# EAGLE design Cmp and Inv (EAGLE 5.11)

## Sheet 1 of 3
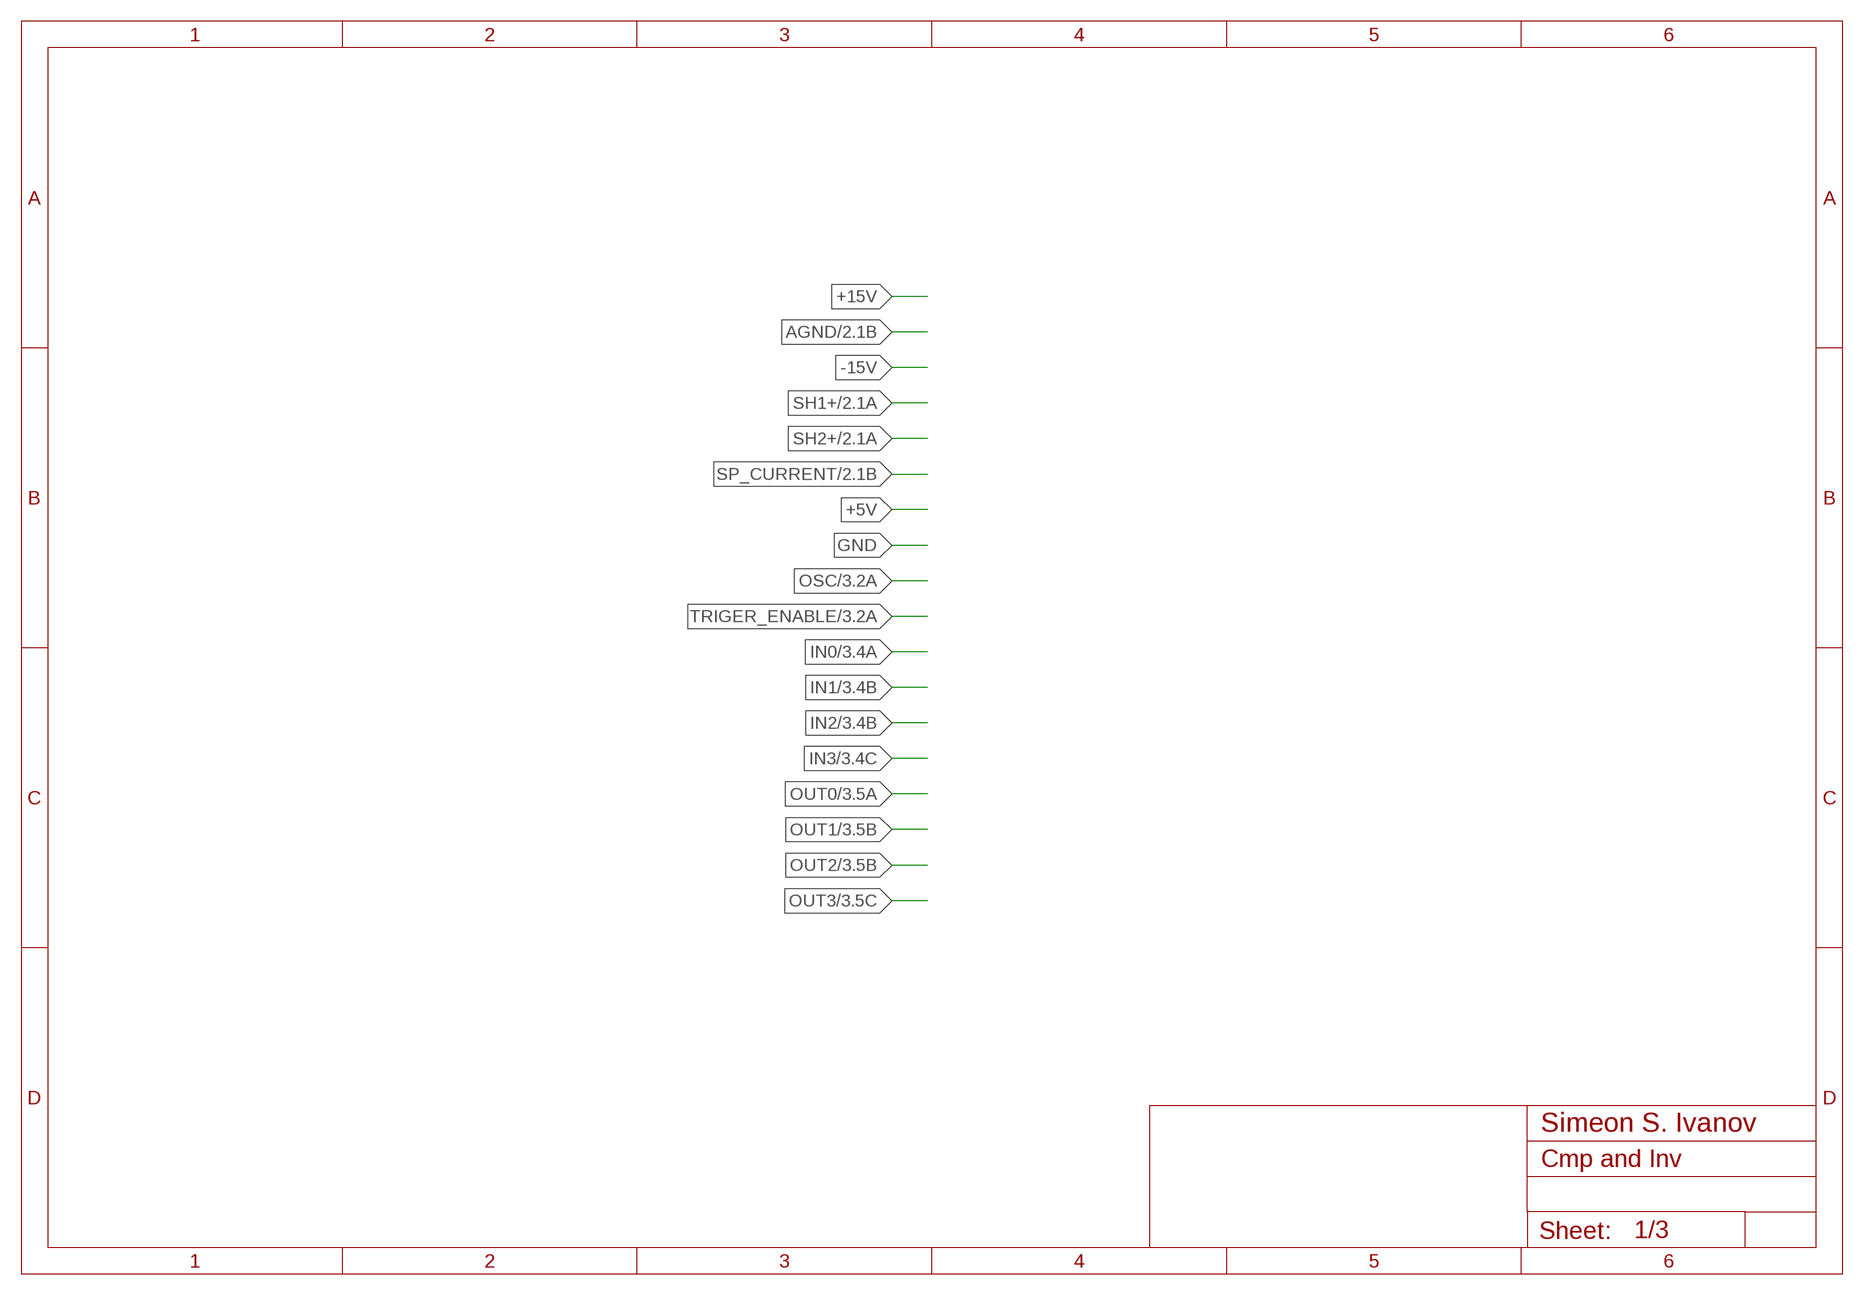
[diagram p0: schematic, sheet 1]

### Notes on the sheet
- Simeon S. Ivanov

## Sheet 2 of 3
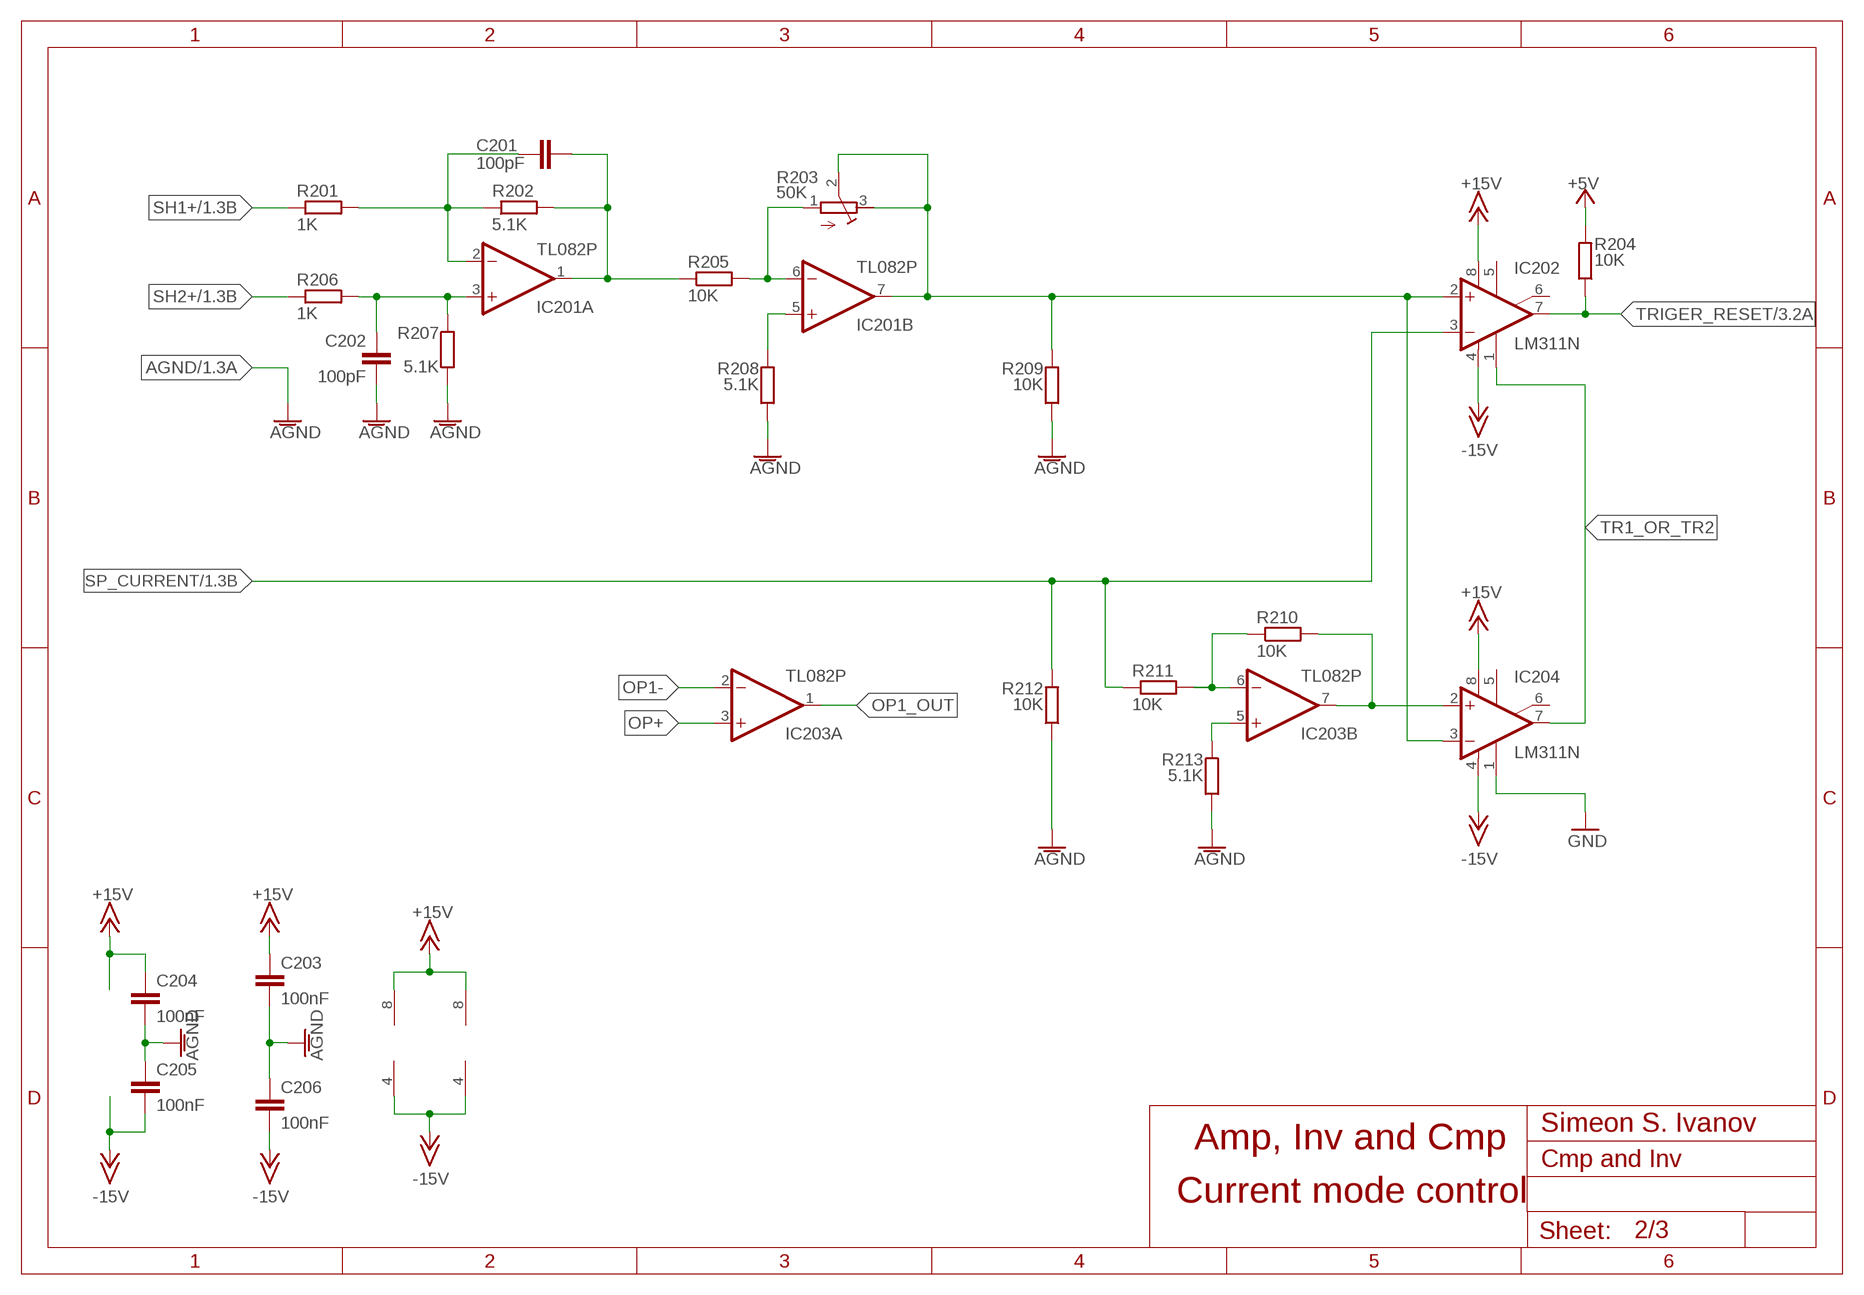
[diagram p1: schematic, sheet 2]

### Parts
C201  100pF  C-EU025-024X044  [C025-024X044]
C202  100pF  C-EU025-024X044  [C025-024X044]
C203  100nF  C-EUC0603  [C0603]
C204  100nF  C-EUC0603  [C0603]
C205  100nF  C-EUC0603  [C0603]
C206  100nF  C-EUC0603  [C0603]
IC201  TL082P  [DIL08]
IC202  LM311N  [DIL08]
IC203  TL082P  [DIL08]
IC204  LM311N  [DIL08]
R201  1K  R-EU_0204/5  [0204/5]
R202  5.1K  R-EU_0204/5  [0204/5]
R203  50K  R-TRIMM3296W  [RTRIM3296W]
R204  10K  R-EU_0204/5  [0204/5]
R205  10K  R-EU_0204/5  [0204/5]
R206  1K  R-EU_0204/5  [0204/5]
R207  5.1K  R-EU_0204/5  [0204/5]
R208  5.1K  R-EU_0204/5  [0204/5]
R209  10K  R-EU_0204/5  [0204/5]
R210  10K  R-EU_0204/5  [0204/5]
R211  10K  R-EU_0204/5  [0204/5]
R212  10K  R-EU_0204/5  [0204/5]
R213  5.1K  R-EU_0204/5  [0204/5]

### Nets
+5V: R204.2 ; also sheet 1,3
+15V: C203.1 C204.1 IC201.8(P:V+) IC202.8(V+) IC203.8(P:V+) IC204.8(V+) ; also sheet 1
-15V: C205.2 C206.2 IC201.4(P:V-) IC202.4(V-) IC203.4(P:V-) IC204.4(V-) ; also sheet 1
AGND: C202.1 C203.2 C204.2 C205.1 C206.1 R207.2 R208.2 R209.2 R212.1 R213.2 ; also sheet 1
ANALOG_IN_AC: IC201.7(B:OUT) IC202.2(+IN) IC204.3(-IN) R203.2(S) R203.3(A) R209.1
GND: IC204.1(GND) ; also sheet 1,3
N$6: C201.1 IC201.2(A:-IN) R201.2 R202.1
N$10: C202.2 IC201.3(A:+IN) R206.2 R207.1
N$37: IC201.5(B:+IN) R208.1
N$38: IC201.6(B:-IN) R203.1(E) R205.2
N$100: C201.2 IC201.1(A:OUT) R202.2 R205.1
N$102: IC203.7(B:OUT) IC204.2(+IN) R210.2
N$103: IC203.6(B:-IN) R210.1 R211.2
N$104: IC203.5(B:+IN) R213.1
OP1-: IC203.2(A:-IN)
OP1_OUT: IC203.1(A:OUT)
OP+: IC203.3(A:+IN)
SH1+: R201.1 ; also sheet 1
SH2+: R206.1 ; also sheet 1
SP_CURRENT: IC202.3(-IN) R211.1 R212.2 ; also sheet 1
TR1_OR_TR2: IC202.1(GND) IC204.7(OUT)
TRIGER_RESET: IC202.7(OUT) R204.1 ; also sheet 3
Unconnected: IC202.5(ON) IC202.6(ON/STR) IC204.5(ON) IC204.6(ON/STR)

### Notes on the sheet
- Simeon S. Ivanov
- Amp, Inv and Cmp
- Current mode control

## Sheet 3 of 3
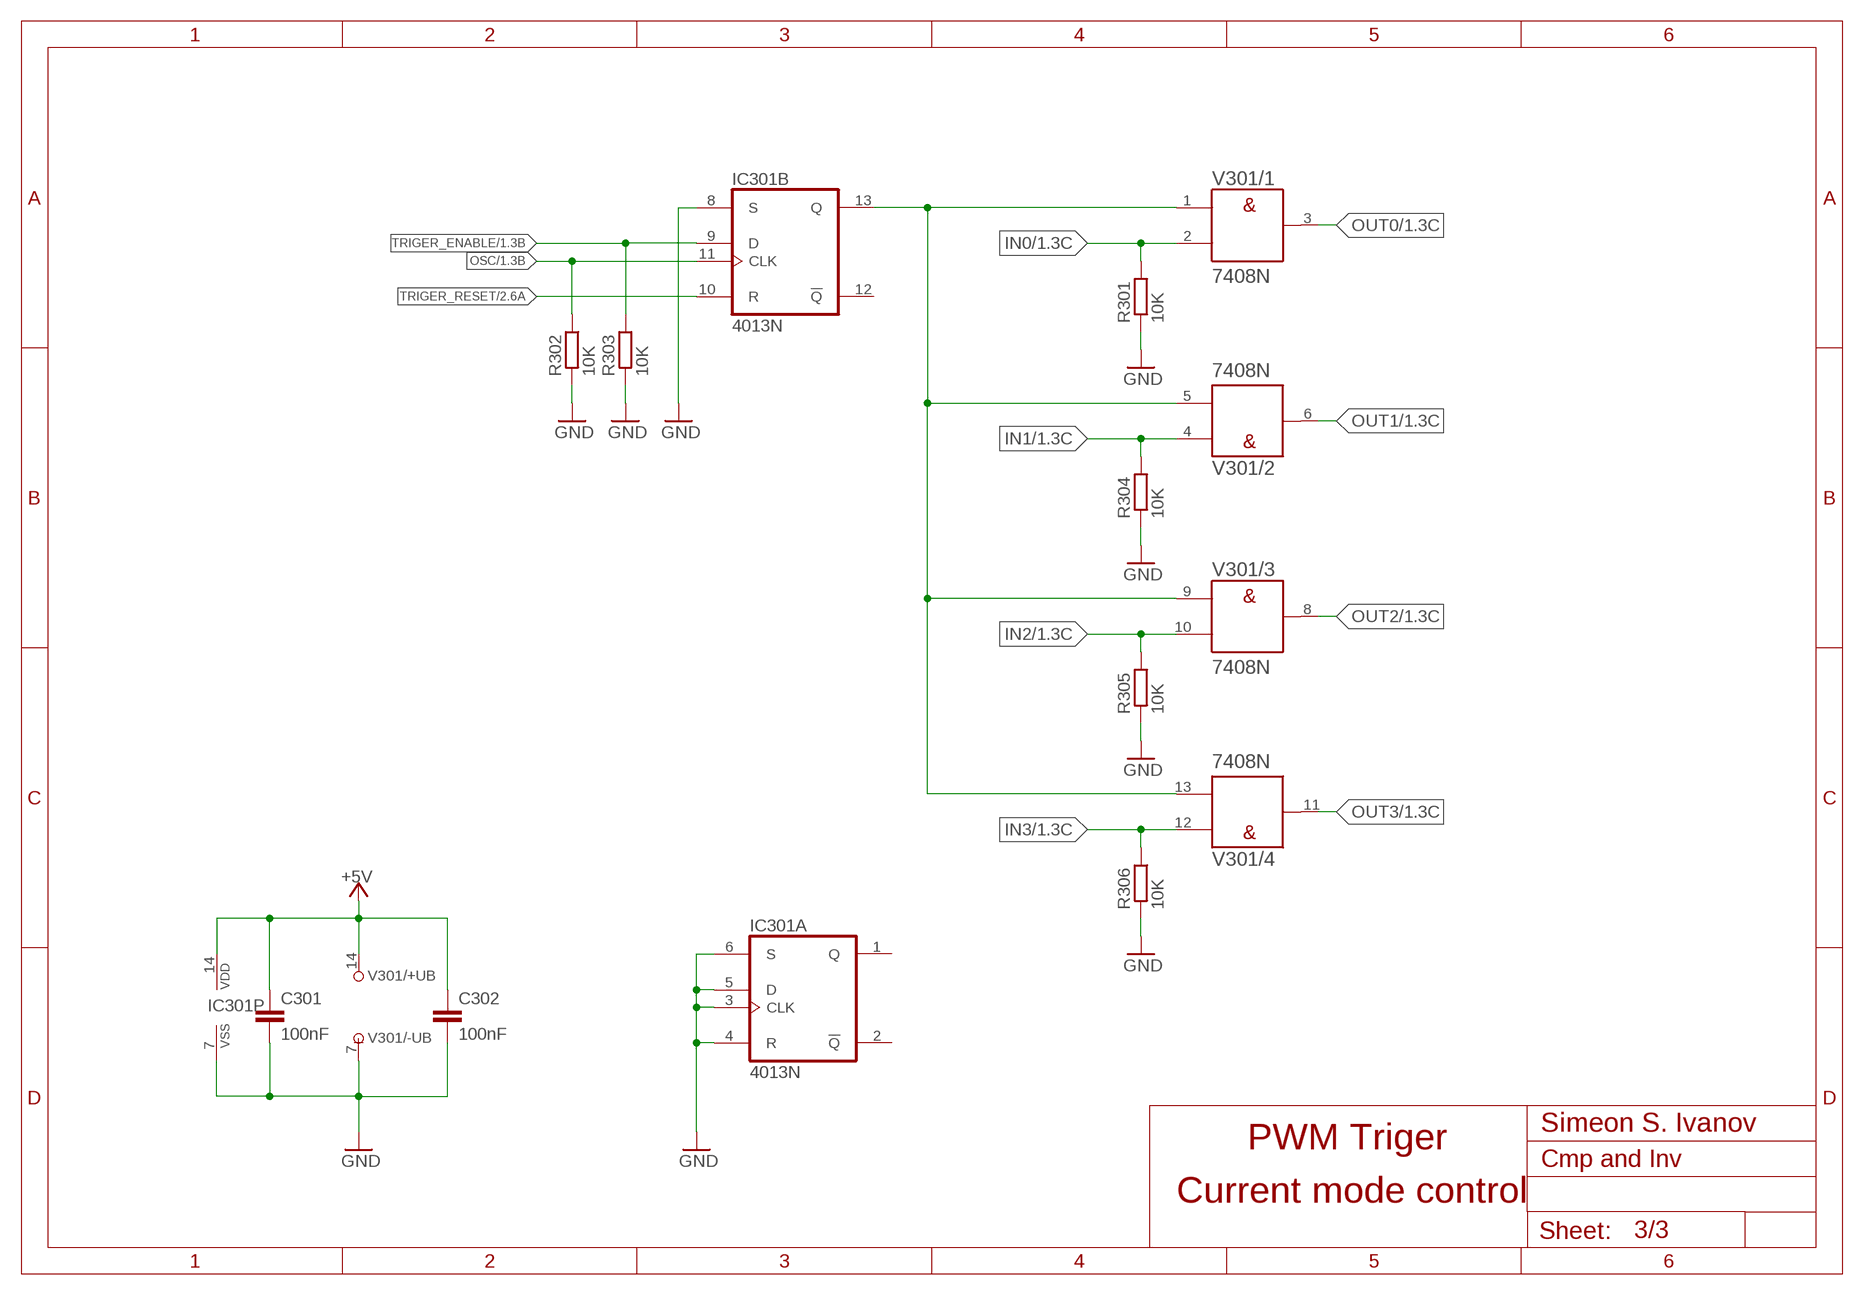
[diagram p2: schematic, sheet 3]

### Parts
C301  100nF  C-EUC0805  [C0805]
C302  100nF  C-EUC0805  [C0805]
IC301  4013N  [DIL14]
R301  10K  R-EU_0204/5  [0204/5]
R302  10K  R-EU_0204/5  [0204/5]
R303  10K  R-EU_0204/5  [0204/5]
R304  10K  R-EU_0204/5  [0204/5]
R305  10K  R-EU_0204/5  [0204/5]
R306  10K  R-EU_0204/5  [0204/5]
V301  7408N  [DIL14]

### Nets
+5V: C301.1 C302.1 IC301.14(P:VDD) V301.14(/+UB:+UB) ; also sheet 1,2
GND: C301.2 C302.2 IC301.3(A:CLK) IC301.4(A:R) IC301.5(A:D) IC301.6(A:S) IC301.7(P:VSS) IC301.8(B:S) R301.2 R302.2 R303.2 R304.2 R305.2 R306.2 V301.7(/-UB:-UB) ; also sheet 1,2
IN0: R301.1 V301.2(/1:B) ; also sheet 1
IN1: R304.1 V301.4(/2:A) ; also sheet 1
IN2: R305.1 V301.10(/3:B) ; also sheet 1
IN3: R306.1 V301.12(/4:A) ; also sheet 1
OSC: IC301.11(B:CLK) R302.1 ; also sheet 1
OUT0: V301.3(/1:Y) ; also sheet 1
OUT1: V301.6(/2:Y) ; also sheet 1
OUT2: V301.8(/3:Y) ; also sheet 1
OUT3: V301.11(/4:Y) ; also sheet 1
TR_EN_GATE: IC301.13(B:Q) V301.1(/1:A) V301.5(/2:B) V301.9(/3:A) V301.13(/4:B)
TRIGER_ENABLE: IC301.9(B:D) R303.1 ; also sheet 1
TRIGER_RESET: IC301.10(B:R) ; also sheet 2
Unconnected: IC301.1(A:Q) IC301.2(A:!Q) IC301.12(B:!Q)

### Notes on the sheet
- Simeon S. Ivanov
- PWM Triger
- Current mode control

## Library data of the parts
C201-C206 C301 C302 = rcl:C-EU: CAPACITOR, European symbol
IC201 IC203 = linear:TL082: OP AMP
IC202 IC204 = linear:LM311: COMPARATOR
IC301 = 40xx:4013: Dual D FLIP FLOP, set/reset
R201 R202 R204-R213 R301-R306 = rcl:R-EU_: RESISTOR, European symbol
R203 = rcl:R-TRIMM: Trimm resistor
V301 = 74ttl-din:74*08: Quad 2-input AND gate

## Board
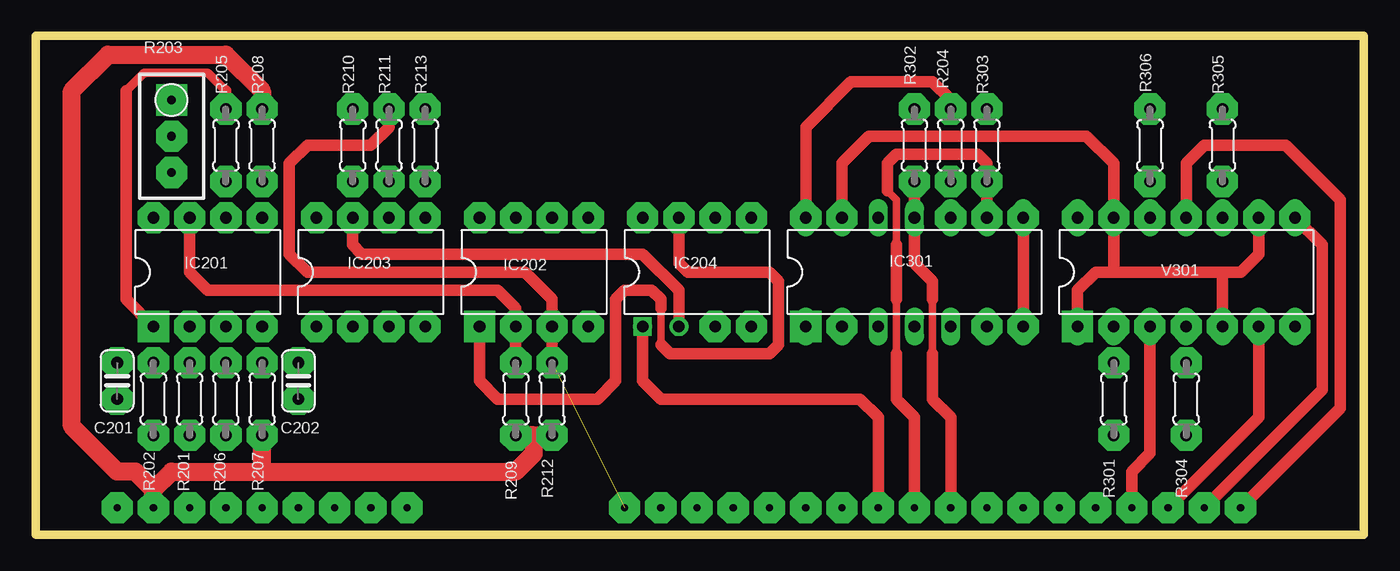
[diagram p3: board, top side]
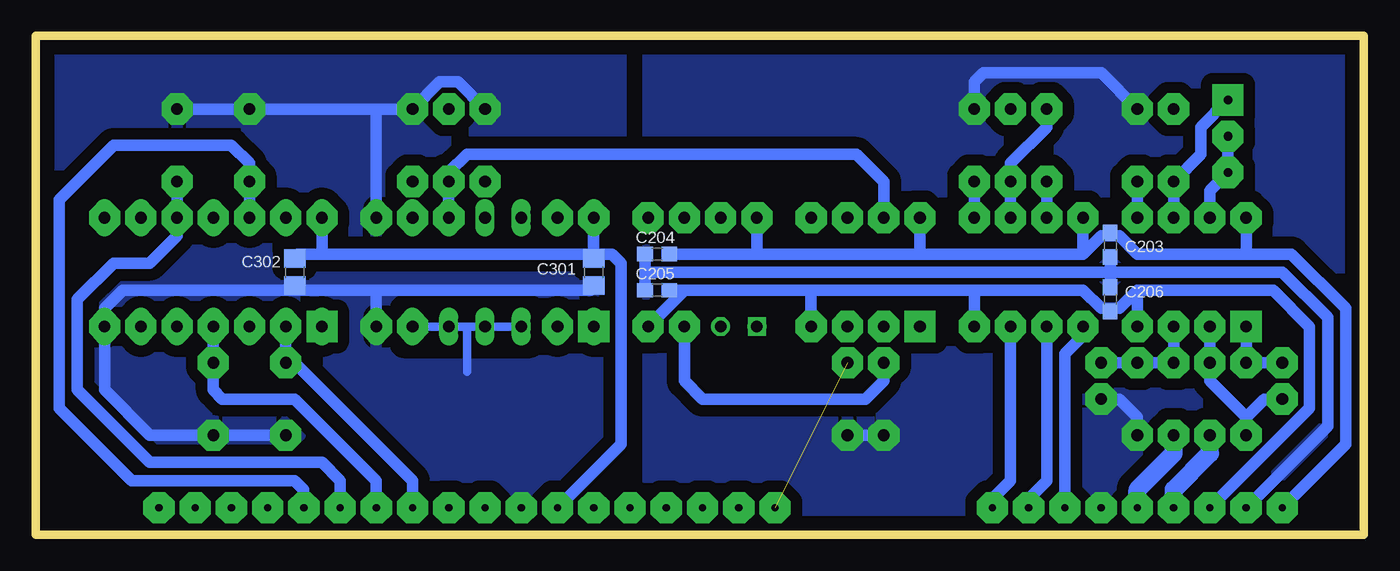
[diagram p4: board, bottom side, seen from below]

Size 93.09 x 34.98 mm. Coordinates in mm from the lower left corner, seen from the top.
Outline: 0,0 93.09,0 93.09,34.98 0,34.98 0,0
Copper layers (1*16): Top 0.035mm / dielectric 1.5mm / Bottom 0.035mm
Design rules "default": minimum track width 10mil, minimum drill 24mil, track to track 8mil, track to pad 8mil, pad to pad 8mil, via to via 8mil, smd to smd 8mil, copper to edge 40mil, drill to drill 8mil, minimum pad ring 10mil, minimum via ring 8mil, stop-mask expansion 4mil, vias tented up to drill 0mil, thermal gap 10mil
bRestrict: area 58.4,13.3 to 67.3,15.9

### Footprints (pad centres in the part's own frame; a part is rotated, then mirrored left to right if it is on the bottom)
C025-024X044 = drill 0.813 octagon: 1 -1.27,0; 2 1.27,0
C0603 = smd 1.1 x 1: 1 -0.85,0; 2 0.85,0
C0805 = smd 1.3 x 1.5: 1 -0.95,0; 2 0.95,0
DIL08 = drill 0.813 pad 1.27 round: 1 -3.81,-3.81; 2 -1.27,-3.81; 3 1.27,-3.81; 4 3.81,-3.81; 5 3.81,3.81; 6 1.27,3.81; 7 -1.27,3.81; 8 -3.81,3.81
DIL14 = drill 0.813 long: 1 -7.62,-3.81; 2 -5.08,-3.81; 3 -2.54,-3.81; 4 0,-3.81; 5 2.54,-3.81; 6 5.08,-3.81; 7 7.62,-3.81; 8 7.62,3.81; 9 5.08,3.81; 10 2.54,3.81; 11 0,3.81; 12 -2.54,3.81; 13 -5.08,3.81; 14 -7.62,3.81
0204/5 = drill 0.813 octagon: 1 -2.54,0; 2 2.54,0
RTRIM3296W = drill 0.61 round: 1 0,-2.54; 2 0,0; 3 0,2.54

### Placement (x,y rotation side)
C201  5.71,10.79 90 top
C202  18.41,10.79 90 top
C203  17.78,20.32 270 bottom
C204  49.53,19.68 180 bottom
C205  49.53,17.14 0 bottom
C206  17.78,16.51 270 bottom
C301  53.98,18.41 270 bottom
C302  74.93,18.41 270 bottom
IC201  12.06,18.41 0 top
IC202  34.92,18.41 0 top
IC203  23.5,18.41 0 top
IC204  46.35,18.41 0 top
IC301  61.59,18.41 0 top
R201  10.79,9.53 90 top
R202  8.26,9.53 90 top
R203  9.53,27.94 180 top
R204  64.14,27.3 90 top
R205  13.34,27.3 270 top
R206  13.34,9.53 90 top
R207  15.88,9.53 270 top
R208  15.88,27.3 90 top
R209  33.66,9.53 270 top
R210  22.23,27.3 270 top
R211  24.77,27.3 270 top
R212  36.2,9.53 90 top
R213  27.3,27.3 90 top
R301  75.56,9.53 270 top
R302  61.59,27.3 90 top
R303  66.67,27.3 90 top
R304  80.64,9.53 270 top
R305  83.19,27.3 90 top
R306  78.11,27.3 90 top
V301  80.64,18.41 0 top

### Tracks (layer width: path | path; a pad name or v marks a point on that pad's centre or on a via)
+5V  (via drill 0.5 pad 2.18)
  Top 0.813: R204.2 64.14,30.48 62.87,31.75 57.15,31.75 53.98,28.57 v53.98,22.23
  Bottom 0.813: 53.98,19.68 73.03,19.68 | 73.03,19.68 v73.03,22.23 | 53.98,19.68 v53.98,22.23 | 53.98,19.68 52.7,19.68 52.07,19.05 52.07,6.35 v56.52,1.91 | 73.03,19.68 74.61,19.68 arc-90 C302.1 | 53.98,19.68 C301.1
  other vias: 64.14,29.84
+15V  (via drill 0.5 pad 2.18)
  Bottom 0.813: 8.26,19.68 v8.26,22.23 | 8.26,19.68 15.88,19.68 17.14,20.95 17.78,20.95 | 17.78,20.95 18.41,20.95 19.68,19.68 | 19.68,19.68 31.11,19.68 | 31.11,19.68 42.55,19.68 | 42.55,19.68 v42.55,22.23 | 31.11,19.68 v31.11,22.23 | 19.68,19.68 v19.68,22.23 | 42.55,19.68 C204.1 | 17.78,20.95 C203.1 | v5.71,1.91 1.27,6.35 1.27,15.88 5.08,19.68 8.26,19.68
-15V  (via drill 0.5 pad 2.18)
  Bottom 0.813: 27.3,17.14 v27.3,14.61 | 15.88,17.14 6.35,17.14 3.81,14.61 3.81,8.89 v10.79,1.91 | 15.88,17.14 17.14,15.88 17.78,15.88 | 17.78,15.88 18.41,15.88 19.68,17.14 27.3,17.14 | 27.3,17.14 38.73,17.14 | 38.73,17.14 47.62,17.14 | 47.62,17.14 v50.16,14.61 | 38.73,17.14 v38.73,14.61 | 15.88,17.14 v15.88,14.61 | 47.62,17.14 C205.2 | 17.78,15.88 C206.2
AGND  (via drill 0.5 pad 2.18)
  Top 1.27: v8.26,1.91 8.26,3.17 | 8.26,3.17 6.99,4.45 5.71,4.45 2.54,7.62 2.54,31.11 5.08,33.66 13.34,33.66 15.88,31.11 R208.2 | 8.26,3.17 9.53,4.45 15.88,4.45 | 15.88,4.45 33.66,4.45 34.92,5.71 34.92,6.99 | 34.92,6.99 R209.2 | 34.92,6.99 R212.1 | 15.88,4.45 R207.2
  Bottom 0.813: R208.2 18.41,32.38 26.67,32.38 27.3,31.75 R213.2 | 50.38,18.41 C205.1 | 50.38,18.41 C204.2 | 17.78,18.41 50.38,18.41 | 17.78,18.41 C206.1 | 17.78,18.41 C203.2 | 17.78,18.41 5.71,18.41 2.54,15.24 2.54,7.62 v8.26,1.91 | R207.2 15.88,8.26 17.14,9.53 C202.1 | R209.2 R212.1
  other vias: 18.41,9.53 15.88,6.99 15.88,29.84 27.3,29.84 36.2,6.99 33.66,6.99 18.41,1.91
  pour Bottom (isolate 0.813): 50.16,34.92 50.16,0 0,0 0,34.92
ANALOG_IN_AC  (via drill 0.5 pad 2.18)
  Top 0.813: v10.79,22.23 10.79,18.41 12.06,17.14 32.38,17.14 33.66,15.88 v33.66,14.61 v33.66,12.06
  Bottom 0.813: R203.2 R203.3 10.79,24.13 v10.79,22.23 | v47.62,14.61 47.62,10.79 46.35,9.53 36.2,9.53 34.92,9.53 33.66,10.79 v33.66,12.06
  other vias: 9.53,25.4 9.53,27.94
GND  (via drill 0.5 pad 1.27, 0.5 pad 2.18)
  Top 0.813: v69.22,14.61 v69.22,22.23 | v42.55,14.61 42.55,10.79 43.81,9.53 57.78,9.53 59.05,8.26 v59.05,1.91
  Bottom 0.61: v59.05,14.61 v61.59,14.61 62.87,14.61 | 62.87,14.61 v64.14,14.61 v66.67,14.61 | 62.87,14.61 62.87,11.43
  Bottom 0.813: 69.22,17.14 v69.22,14.61 | 69.22,17.14 74.93,17.14 | 74.93,17.14 87,17.14 88.27,15.88 v88.27,14.61 88.27,10.16 85.09,6.99 R304.2 R301.2 | v69.22,22.23 69.22,29.84 | 69.22,29.84 R303.2 64.77,31.75 63.5,31.75 R302.2 | 69.22,29.84 R306.2 R305.2 | 74.93,17.14 C302.2 | 69.22,17.14 54.3,17.14 arc-90 C301.2
  other vias: 83.19,29.84 75.56,6.99 80.64,6.99 78.11,29.84 66.67,29.84 61.59,29.84
  pour Bottom (isolate 0.813, rank 2): 52.07,0 52.07,34.92 93.34,34.92 93.34,0
IN0  (via drill 0.5 pad 2.18)
  Bottom 0.813: v75.56,14.61 v75.56,12.06 74.93,12.06 66.67,3.81 v66.67,1.91
IN1  (via drill 0.5 pad 2.18)
  Bottom 0.813: v80.64,14.61 v80.64,12.06 80.64,10.16 80.01,9.53 74.93,9.53 69.22,3.81 v69.22,1.91
IN2  (via drill 0.5 pad 2.18)
  Bottom 0.813: R305.1 v83.19,22.23 83.19,20.95 85.09,19.05 87.63,19.05 90.17,16.51 90.17,10.16 85.09,5.08 73.03,5.08 71.75,3.81 v71.75,1.91
  other vias: 83.19,24.77
IN3  (via drill 0.5 pad 2.18)
  Bottom 0.813: v74.3,1.91 74.3,3.17 74.93,3.81 86.36,3.81 91.44,8.89 91.44,23.5 87.63,27.3 79.38,27.3 78.11,26.04 R306.1 v78.11,22.23
  other vias: 78.11,24.77
N$4  (via drill 0.5 pad 2.18)
  other vias: 36.2,22.23
N$5  (via drill 0.5 pad 2.18)
  other vias: 38.73,22.23
N$6  (via drill 0.5 pad 2.18)
  Bottom 0.813: v10.79,14.61 v10.79,12.06 10.79,10.79 8.26,8.26 | 8.26,8.26 R202.1 8.26,8.26 | C201.1 6.99,9.53 8.26,8.26
  other vias: 8.26,6.99 5.71,9.53
N$7  (via drill 0.5 pad 2.18)
  other vias: 47.62,22.23
N$8  (via drill 0.5 pad 2.18)
  other vias: 50.16,22.23
N$9  (via drill 0.5 pad 2.18)
  other vias: 53.98,14.61
N$10  (via drill 0.5 pad 2.18)
  Bottom 0.813: v13.34,14.61 v13.34,12.06 v15.88,12.06 C202.2
  other vias: 18.41,12.06
N$11  (via drill 0.5 pad 2.18)
  other vias: 53.98,1.91
N$12  (via drill 0.5 pad 2.18)
  other vias: 56.52,14.61
N$13  (via drill 0.5 pad 1.27)
  other vias: 59.05,22.23
N$15  (via drill 0.5 pad 2.18)
  other vias: 51.44,1.91
N$16  (via drill 0.5 pad 2.18)
  other vias: 48.9,1.91
N$17  (via drill 0.5 pad 2.18)
  other vias: 46.35,1.91
N$18  (via drill 0.5 pad 2.18)
  other vias: 43.81,1.91
N$37  (via drill 0.5 pad 2.18)
  Bottom 0.813: v15.88,22.23 R208.1
  other vias: 15.88,24.77
N$38  (via drill 0.5 pad 2.18)
  Bottom 0.813: v13.34,22.23 R205.2 11.43,26.67 11.43,28.57 R203.1
  other vias: 9.53,30.48 13.34,24.77
N$100  (via drill 0.5 pad 2.18)
  Top 0.61: 13.34,31.11 12.06,32.38 7.62,32.38 6.35,31.11
  Top 0.813: 13.34,31.11 R205.1 | 6.35,31.11 6.35,16.51 v8.26,14.61
  Bottom 0.813: v8.26,14.61 v8.26,12.06 C201.2
  other vias: 5.71,12.06 13.34,29.84
N$102  (via drill 0.5 pad 1.27, 0.5 pad 2.18)
  Top 0.813: v45.09,14.61 45.09,17.14 42.55,19.68 22.86,19.68 22.23,20.32 v22.23,22.23
  Bottom 0.813: v22.23,22.23 R210.2
  other vias: 22.23,24.77
N$103  (via drill 0.5 pad 2.18)
  Bottom 0.813: v24.77,22.23 R211.2 24.77,26.04 22.23,28.57 R210.1
  other vias: 24.77,24.77 22.23,29.84
N$104  (via drill 0.5 pad 2.18)
  Bottom 0.813: v27.3,22.23 R213.1
  other vias: 27.3,24.77
OP1+  (via drill 0.5 pad 2.18)
  Bottom 0.813: v26.04,1.91 26.04,2.54 24.77,3.81 v24.77,14.61
OP1-  (via drill 0.5 pad 2.18)
  Bottom 0.813: v23.5,1.91 23.5,2.54 22.23,3.81 v22.23,14.61
OP1_OUT  (via drill 0.5 pad 2.18)
  Bottom 0.813: v20.95,1.91 20.95,12.7 19.68,13.97 v19.68,14.61
OSC  (via drill 0.5 pad 1.27, 0.5 pad 2.18)
  Top 0.508: 62.87,12.7 62.87,16.51
  Top 0.813: 62.87,16.51 62.87,17.78 61.59,19.05 v61.59,22.23 R302.1 | v64.14,1.91 64.14,8.26 62.87,9.53 62.87,12.7
  other vias: 61.59,24.77
OUT0  (via drill 0.5 pad 2.18)
  Top 0.813: v76.83,1.91 76.83,4.45 78.11,5.71 v78.11,14.61
OUT1  (via drill 0.5 pad 2.18)
  Top 0.813: v79.38,1.91 85.72,8.26 v85.72,14.61
OUT2  (via drill 0.5 pad 2.18)
  Top 0.813: v81.92,1.91 90.17,10.16 90.17,20.32 v88.27,22.23
OUT3  (via drill 0.5 pad 2.18)
  Top 0.813: v84.45,1.91 91.44,8.89 91.44,23.5 87.63,27.3 81.92,27.3 80.64,26.04 v80.64,22.23
SH1+  (via drill 0.5 pad 2.18)
  Bottom 1.27: v13.34,1.91 13.34,3.17 10.79,5.71 R201.1
  other vias: 10.79,6.99
SH2+  (via drill 0.5 pad 2.18)
  Bottom 1.27: v15.88,1.91 15.88,3.17 13.34,5.71 R206.1
  other vias: 13.34,6.99
SP_CURRENT  (via drill 0.5 pad 2.18)  (1 unrouted)
  Top 0.813: R211.1 24.77,28.57 23.5,27.3 19.05,27.3 17.78,26.04 17.78,19.68 19.05,18.41 34.29,18.41 36.2,16.51 v36.2,14.61 v36.2,12.06
  other vias: 24.77,29.84 41.27,1.91
TR1_OR_TR2  (via drill 0.5 pad 2.18)
  Top 0.508: 43.81,15.88 43.81,13.34
  Top 0.813: v45.09,22.23 45.09,19.05 45.72,18.41 51.44,18.41 52.07,17.78 52.07,13.34 51.44,12.7 44.45,12.7 43.81,13.34 | 43.81,15.88 43.81,16.51 43.18,17.14 41.27,17.14 40.64,16.51 40.64,10.79 39.37,9.53 32.38,9.53 31.11,10.79 v31.11,14.61
TR_EN_GATE  (via drill 0.5 pad 2.18)
  Top 0.813: v73.03,14.61 73.03,17.14 74.3,18.41 75.56,18.41 | v85.72,22.23 85.72,19.68 84.45,18.41 83.19,18.41 | 75.56,18.41 83.19,18.41 | 75.56,18.41 v75.56,22.23 75.56,26.04 73.66,27.94 58.42,27.94 56.52,26.04 v56.52,22.23 | 83.19,18.41 v83.19,14.61
TRIGER_ENABLE  (via drill 0.5 pad 2.18)
  Top 0.508: 60.33,12.7 60.33,16.51 | 60.33,20.32 60.33,23.5 59.69,24.13
  Top 0.813: v61.59,1.91 61.59,8.26 60.33,9.53 60.33,12.7 | 60.33,16.51 60.33,20.32 | v66.67,22.23 R303.1 66.67,26.04 66.04,26.67 60.33,26.67 59.69,26.04 59.69,24.13
  other vias: 66.67,24.77
TRIGER_RESET  (via drill 0.5 pad 2.18)
  Bottom 0.813: v64.14,22.23 R204.1 64.14,25.4 62.87,26.67 35.56,26.67 33.66,24.77 v33.66,22.23
  other vias: 64.14,24.77

### Text on the board
tDocu: Current PWM.lbr (19.06.15) | 1 | 2 | 3 | 4 | 5 | 6 | 7 | 8 | 9 | 10 | 11 | 12 | 13 | 14 | 15 | 16 | 17 | 18 | 19 | 20 | 21 | 22 | 23 | 24 | 25 | 26 | 27 | +15V | AGND | -15V | SH1+ | SH2+ | AGND | OP1+ | OP1- | OP1+ | SP_CURRENT | NC | NC | NC | NC | NC | +5V | GND | TRIGER_ENABLE | OSC | IN0 | IN1 | IN2 | IN3 | OUT0 | OUT1 | OUT2 | OUT3